# EAGLE design Qwiic_USB_Bridge_SAMD21E (EAGLE 9.5.2)
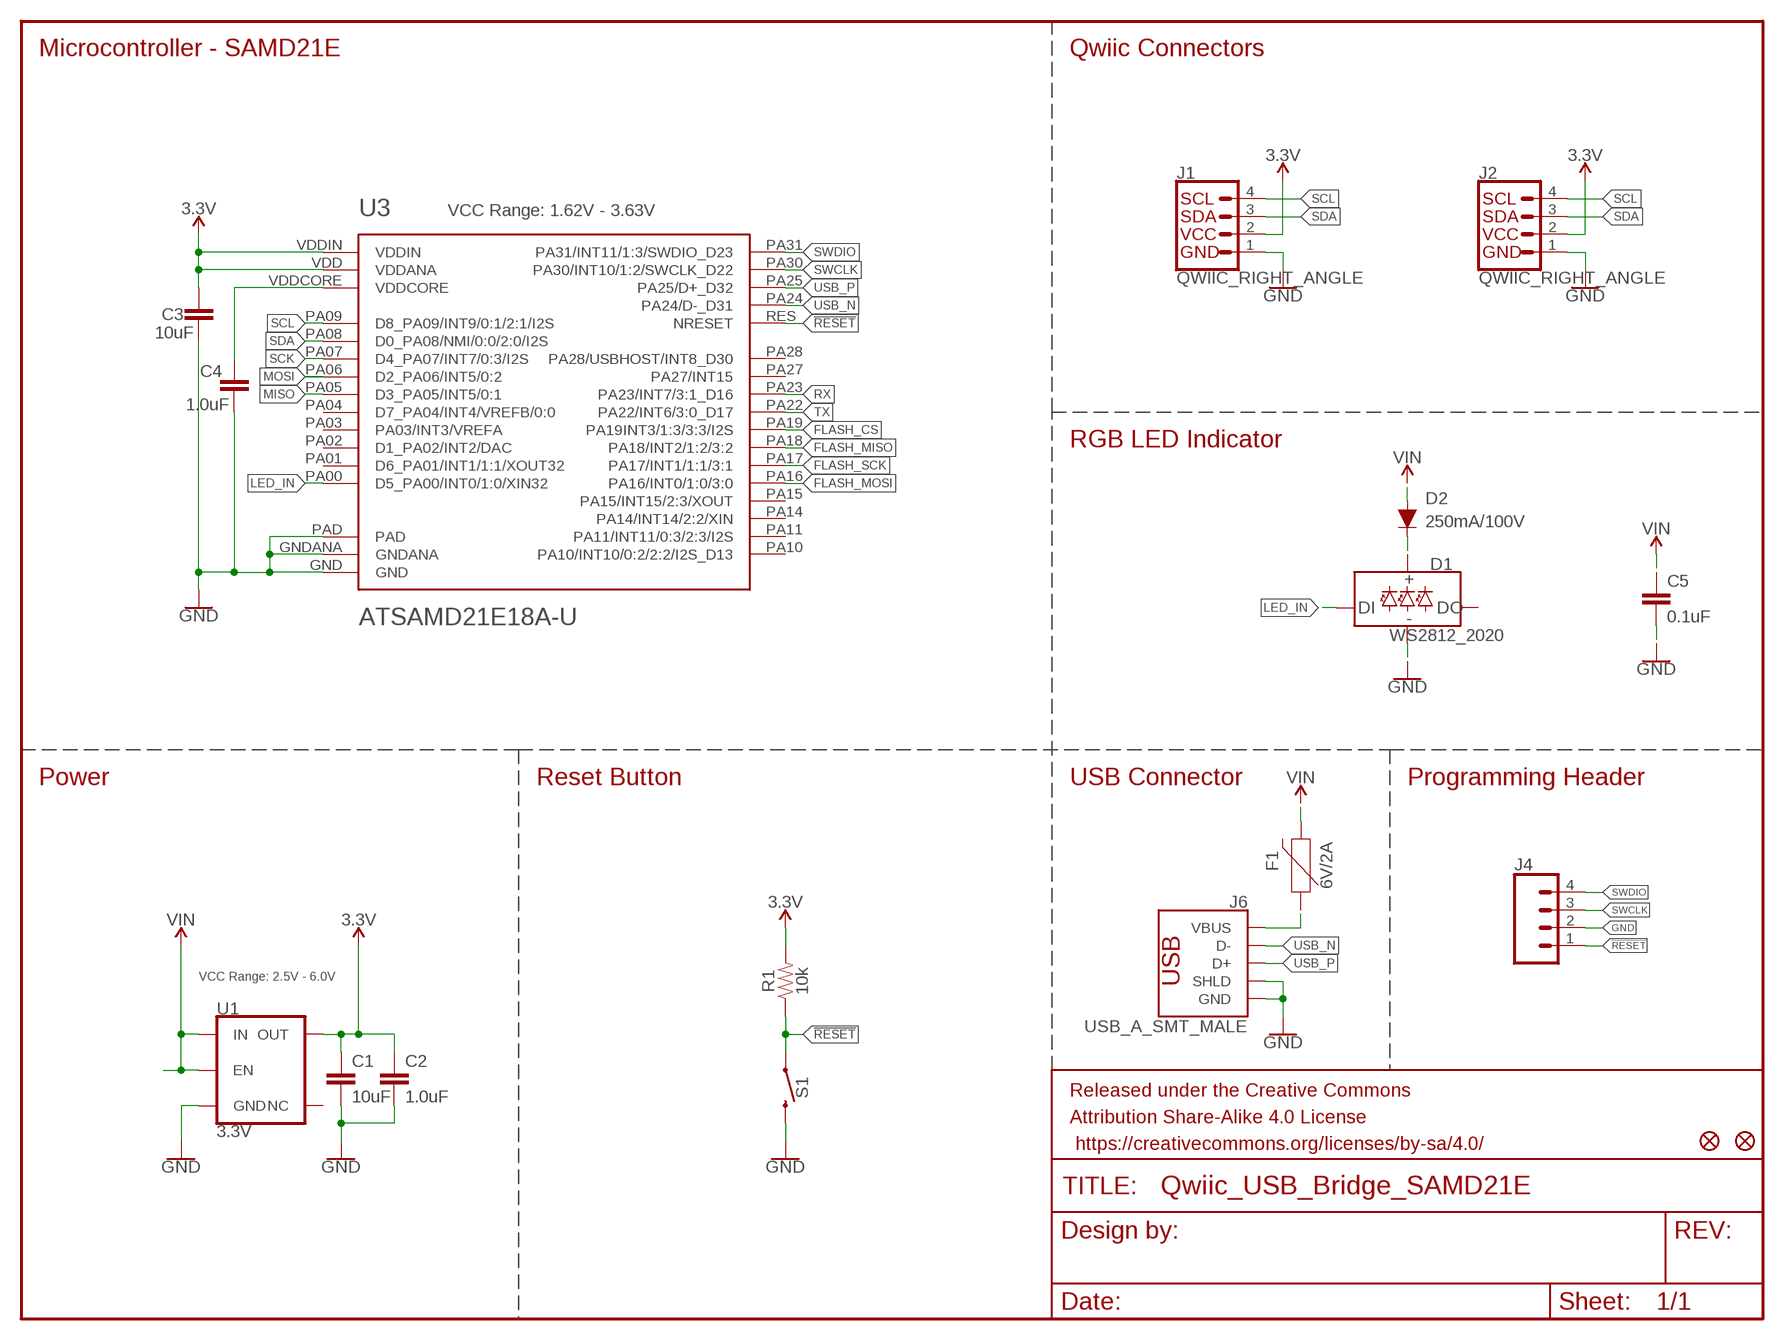
[diagram p0: schematic, sheet 1]

## Parts
C1  10uF  10UF-0603-6.3V-20%  [0603]
C2  1.0uF  1.0UF-0402-16V-10%  [0402]
C3  10uF  10UF-0603-6.3V-20%  [0603]
C4  1.0uF  1.0UF-0402-16V-10%  [0402]
C5  0.1uF  0.1UF-0603-25V-(+80/-20%)  [0603]
D1  WS2812_2020  [WS2812-2020]
D2  250mA/100V  DIODE-BAS16J  [SOD-323]
F1  6V/2A  PPTC_6V2A  [1210]
FD1  FIDUCIALUFIDUCIAL  [FIDUCIAL-MICRO]
FD2  FIDUCIALUFIDUCIAL  [FIDUCIAL-MICRO]
FRAME2  FRAME-LETTER  [CREATIVE_COMMONS]
J1  QWIIC_RIGHT_ANGLE  QWIIC_CONNECTORJS-1MM  [JST04_1MM_RA]
J2  QWIIC_RIGHT_ANGLE  QWIIC_CONNECTORJS-1MM  [JST04_1MM_RA]
J4  CONN_041.27MM_NO_SILK  [1X04_1.27MM_NO_SILK]
J6  USB_A_SMT_MALE  [USB-A-SMT-MALE]
R1  10k  10KOHM-0603-1/10W-1%  [0603]
S1  MOMENTARY-SWITCH-SPST-SMD-6.0X3.5MM  [TACTILE_SWITCH_SMD_6.0X3.5MM]
U1  3.3V  V_REG_AP2112K-3.3V  [SOT23-5]
U3  ATSAMD21E18A-U  [QFN-32_SAMD]

## Nets
3.3V: C1.1 C2.1 C3.1 J1.2 J2.2 R1.2 U1.5(OUT) U3.VDD(VDDANA) U3.VDDIN
!RESET: J4.1 R1.1 S1.1 U3.RES(NRESET)
FLASH_CS: U3.PA19(PA19INT3/1:3/3:3/I2S)
FLASH_MISO: U3.PA18(PA18/INT2/1:2/3:2)
FLASH_MOSI: U3.PA16(PA16/INT0/1:0/3:0)
FLASH_SCK: U3.PA17(PA17/INT1/1:1/3:1)
GND: C1.2 C2.2 C3.2 C4.1 C5.2 D1.GND J1.1 J2.1 J4.2 J6.GND1(GND) J6.SHLD1(SHLD) J6.SHLD2(SHLD) S1.2 U1.2(GND) U3.GND U3.GNDANA U3.PAD
LED_IN: D1.DI U3.PA00(D5_PA00/INT0/1:0/XIN32)
MISO: U3.PA05(D3_PA05/INT5/0:1)
MOSI: U3.PA06(D2_PA06/INT5/0:2)
N$1: F1.1 J6.VBUS1(VBUS)
N$2: D1.VCC D2.C
RX: U3.PA23(PA23/INT7/3:1_D16)
SCK: U3.PA07(D4_PA07/INT7/0:3/I2S)
SCL: J1.4 J2.4 U3.PA09(D8_PA09/INT9/0:1/2:1/I2S)
SDA: J1.3 J2.3 U3.PA08(D0_PA08/NMI/0:0/2:0/I2S)
SWCLK: J4.3 U3.PA30(PA30/INT10/1:2/SWCLK_D22)
SWDIO: J4.4 U3.PA31(PA31/INT11/1:3/SWDIO_D23)
TX: U3.PA22(PA22/INT6/3:0_D17)
USB_N: J6.D-1(D-) U3.PA24(PA24/D-_D31)
USB_P: J6.D+1(D+) U3.PA25(PA25/D+_D32)
VDDCORE: C4.2 U3.VDDCORE
VIN: C5.1 D2.A F1.2 U1.1(IN) U1.3(EN)
Unconnected: D1.DO U1.4(NC) U3.PA01(D6_PA01/INT1/1:1/XOUT32) U3.PA02(D1_PA02/INT2/DAC) U3.PA03(PA03/INT3/VREFA) U3.PA04(D7_PA04/INT4/VREFB/0:0) U3.PA10(PA10/INT10/0:2/2:2/I2S_D13) U3.PA11(PA11/INT11/0:3/2:3/I2S) U3.PA14(PA14/INT14/2:2/XIN) U3.PA15(PA15/INT15/2:3/XOUT) U3.PA27(PA27/INT15) U3.PA28(PA28/USBHOST/INT8_D30)

## Notes on the sheet
- Microcontroller - SAMD21E | Qwiic Connectors
- U3 | VCC Range: 1.62V - 3.63V
- RGB LED Indicator
- Power | Reset Button | USB Connector | Programming Header
- VCC Range: 2.5V - 6.0V

## Library data of the parts
C1 C3 = SparkFun-Capacitors:10UF: 10.0µF ceramic capacitors A capacitor is a passive two-terminal electrical component used to store electrical energy temporarily in an electric field.; PROD_ID: CAP-11015
C2 C4 = SparkFun-Capacitors:1.0UF: 1µF ceramic capacitors A capacitor is a passive two-terminal electrical component used to store electrical energy temporarily in an electric field.; PROD_ID: CAP-12417
C5 = SparkFun-Capacitors:0.1UF: 0.1µF ceramic capacitors A capacitor is a passive two-terminal electrical component used to store electrical energy temporarily in an electric field.; PROD_ID: CAP-00810
D1 = SparkFun-LED:WS2812: Addressable RGB LED - 1 Wire Common names: WS2812, SK6812, Neopixel, APA-106, etc. SMD LED with built-in controller IC. Color: Red/Green/Blue SparkFun Products: LED-SMD RGB (WS2812) <https://www.sparkfun.com/products/11821> LED - RGB Addressable, PTH, 5mm Diffused (5 Pack) <https://www.sparkfun.com/products/12986> LED - RGB Addressable, PTH, 5mm Clear (5 Pack) <https://www.sparkfun.com/products/12999> Blynk Board - ESP8266 <https://www.sparkfun.com/products/13794> Datasheet referenced for footprint: WS2812B-PTH <https://cdn.sparkfun.com/datasheets/Components/LED/COM-12877.pdf>; PROD_ID: DIO-15591
D2 = SparkFun-DiscreteSemi:DIODE: Diode These are standard reverse protection diodes and small signal diodes. SparkFun Products: SparkFun SparkPunk Sound Kit <https://www.sparkfun.com/products/11177> SparkFun ESP8266 Thing <https://www.sparkfun.com/products/13231>; PROD_ID: DIO-09646
F1 = SparkFun-Fuses:PPTC: Resettable Fuse PPTC Resettable Fuse. Really a sort of resistor with a polymeric positive temperature coefficient whose resistance increases dramatically with an increase in temperature. When heated by the power passing through the resistance rises causing the current to be limited, protecting the circuit. This is achieved by the transition of the polymer from a crystalline to an amorphous state where the conductive carbon separates breaking the conductive pathways found in the cool crystalline structure. When a PPTC cools back down it resumes conducting letting the circuit turn back on. SparkFun Products: SparkFun RedBoard - Programmed with Arduino <https://www.sparkfun.com/products/12757> Pro Micro - 5V/16MHz <https://www.sparkfun.com/products/12640> Arduino Pro 328 - 5V/16MHz <https://www.sparkfun.com/products/10915> MP3 Trigger <https://www.sparkfun.com/products/13720>; PROD_ID: RES-14313
FD1 FD2 = SparkFun-Aesthetics:FIDUCIAL: Fiducial Alignment Points Point-of-reference for pick-and-place machines and other optical instruments.
FRAME2 = SparkFun-Aesthetics:FRAME-LETTER: Schematic Frame - Letter Standard 8.5x11 US Letter frame
J1 J2 = SparkFun-Connectors:QWIIC_CONNECTOR: SparkFun I2C Standard Qwiic Connector An SMD 1mm pitch JST connector makes it easy and quick (get it? Qwiic?) to connect I2C devices to each other. The Qwiic system <http://www.sparkfun.com/qwiic> enables fast and solderless connection between popular platforms and various sensors and actuators. We carry 200mm <https://www.sparkfun.com/products/14204>, 100mm <https://www.sparkfun.com/products/14205>, 50mm <https://www.sparkfun.com/products/14206>, and breadboard friendly <https://www.sparkfun.com/products/14207> Qwiic cables. We also offer 10 pcs strips <https://www.sparkfun.com/products/14323> the SMD connectors.; PROD_ID: CONN-13694
J4 = SparkFun-Connectors:CONN_04: Multi connection point. Often used as Generic Header-pin footprint for 0.1 inch spaced/style header connections On any of the 0.1 inch spaced packages, you can populate with these: Break Away Headers - Straight <https://www.sparkfun.com/products/116> (PRT-00116) Break Away Male Headers - Right Angle <https://www.sparkfun.com/products/553> (PRT-00553) Female Headers <https://www.sparkfun.com/products/115> (PRT-00115) Break Away Headers - Machine Pin <https://www.sparkfun.com/products/117> (PRT-00117) Break Away Female Headers - Swiss Machine Pin <https://www.sparkfun.com/products/743> (PRT-00743) For SCREWTERMINALS and SPRING TERMINALS visit here: Screw Terimnals on SparkFun.com <https://www.sparkfun.com/search/results?term=Screw+Terminals> (5mm/3.5mm/2.54mm spacing) This device is also useful as a general connection point to wire up your design to another part of your project. Our various solder wires solder well into these plated through hole pads. Hook-Up Wire - Assortment (Stranded, 22 AWG) <https://www.sparkfun.com/products/11375> (PRT-11375) Hook-Up Wire - Assortment (Solid Core, 22 AWG) <https://www.sparkfun.com/products/11367> (PRT-11367) View the entire wire category on our website here <https://www.sparkfun.com/categories/141> Special notes: Molex polarized connector foot print use with SKU : PRT-08231 with associated crimp pins and housings. 1MM SMD Version SKU: PRT-10208
J6 = SparkFun-Connectors:USB_A: USB-A Connector Male and female variants, as well as PTH and SMT variants SparkFun Products: SparkFun XBee Explorer Dongle <https://www.sparkfun.com/products/11697> PTH Male SparkFun MicroView-USB Programmer <https://www.sparkfun.com/products/12924> SMT Male SparkFun USB Type A Female Breakout <https://www.sparkfun.com/products/12700> SMT Female; PROD_ID: CONN-11499
R1 = SparkFun-Resistors:10KOHM: 10kΩ resistor A resistor is a passive two-terminal electrical component that implements electrical resistance as a circuit element. Resistors act to reduce current flow, and, at the same time, act to lower voltage levels within circuits. - Wikipedia; PROD_ID: RES-00824
S1 = SparkFun-Switches:MOMENTARY-SWITCH-SPST: Momentary Switch (Pushbutton) - SPST Normally-open (NO) SPST momentary switches (buttons, pushbuttons). Variants PTH-12MM - 12mm square, through-hole Momentary Pushbutton Switch - 12mm Square <https://www.sparkfun.com/products/9190> (COM-09190) PTH-6.0MM, PTH-6.0MM-KIT - 6.0mm square, through-hole Mini Pushbutton Switch <https://www.sparkfun.com/products/97> (COM-00097) KIT package intended for soldering kit's - only one side of pads' copper is exposed. PTH-RIGHT-ANGLE-KIT - Right-angle, through-hole Right Angle Tactile Button <https://www.sparkfun.com/products/10791> - Used on SparkFun BigTime Watch Kit <https://www.sparkfun.com/products/11734> SMD-12MM - 12mm square, surface-mount Tactile Button - SMD (12mm) <https://www.sparkfun.com/products/12993> (COM-12993) Used on SparkFun PicoBoard <https://www.sparkfun.com/products/11888> SMD-4.5MM - 4.5mm Square Trackball Switch Used on SparkFun Blackberry Trackballer Breakout <https://www.sparkfun.com/products/13169> SMD-4.6MMX2.8MM - 4.60mm x 2.80mm, surface mount Used on SparkFun Pro Micro - RP2040 <https://www.sparkfun.com/products/17717> SMD-5.2MM, SMD-5.2-REDUNDANT - 5.2mm square, surface-mount Mini Pushbutton Switch - SMD <https://www.sparkfun.com/products/8720> (COM-08720) Used on Arduino Pro Mini <https://www.sparkfun.com/products/11114> REDUNDANT package connects both switch circuits together SMD-6.0X3.5MM - 6.0 x 3.5mm, surface mount Momentary Reset Switch SMD <https://www.sparkfun.com/products/8229> (COM-08229) SMD-6.2MM-TALL - 6.2mm square, surface mount Tactile Button - SMD (6mm) <https://www.sparkfun.com/products/12992> Used on SparkFun Digital Sandbox <https://www.sparkfun.com/products/12651> SMD-RIGHT-ANGLE - Right-angle, surface mount Used on SparkFun Block for Intel® Edison - Arduino <https://www.sparkfun.com/products/13036>; PROD_ID: SWCH-14278; SF_SKU: COM-08229
U1 = SparkFun-IC-Power:V_REG_AP2112: AP2112 - 600mA CMOS LDO Regulator w/ Enable The AP2112 is CMOS process low dropout linear regulator with enable function, the regulator delivers a guaranteed 600mA (min.) continuous load current. Features Output Voltage Accuracy: ±1.5% Output Current: 600mA (Min.) Foldback Short Current Protection: 50mA Enable Function to Turn ON/OFF VOUT Low Dropout Voltage (3.3V): 250mV (Typ.) @IOUT=600mA Excellent Load Regulation: 0.2%/A (Typ.) Excellent Line Regulation: 0.02%/V (Typ.) Low Quiescent Current: 55μA (Typ.) Low Standby Current: 0.01μA (Typ.) Low Output Noise: 50μVRMS PSRR: 100Hz -65dB, 1kHz -65dB OTSD Protection Stable with 1.0μF Flexible Cap: Ceramic, Tantalum and Aluminum Electrolytic Operation Temperature Range: -40°C to 85°C ESD: MM 400V, HBM 4000V; PROD_ID: VREG-12457
U3 = SparkFun-IC-Microcontroller:ATSAMD21E18A-U: SAM D21E 32-Pin QFN The SAMD21E is built around the 32-bit ARM Cortex-M0+ processor with up to 256KB of Flash and 32KB of SRAM. It operates at a maximum frequency of 48MHz.; PROD_ID: IC-14428

## Net classes
1 vcc: width 0 mm

## Board
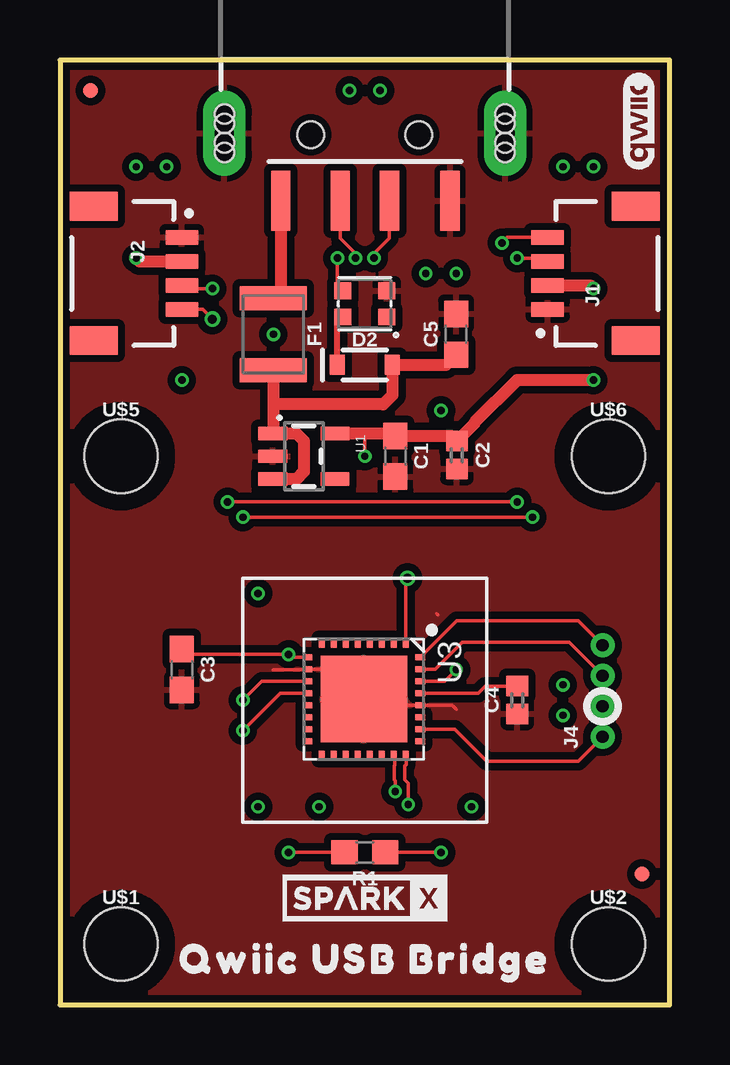
[diagram p1: board, top side]
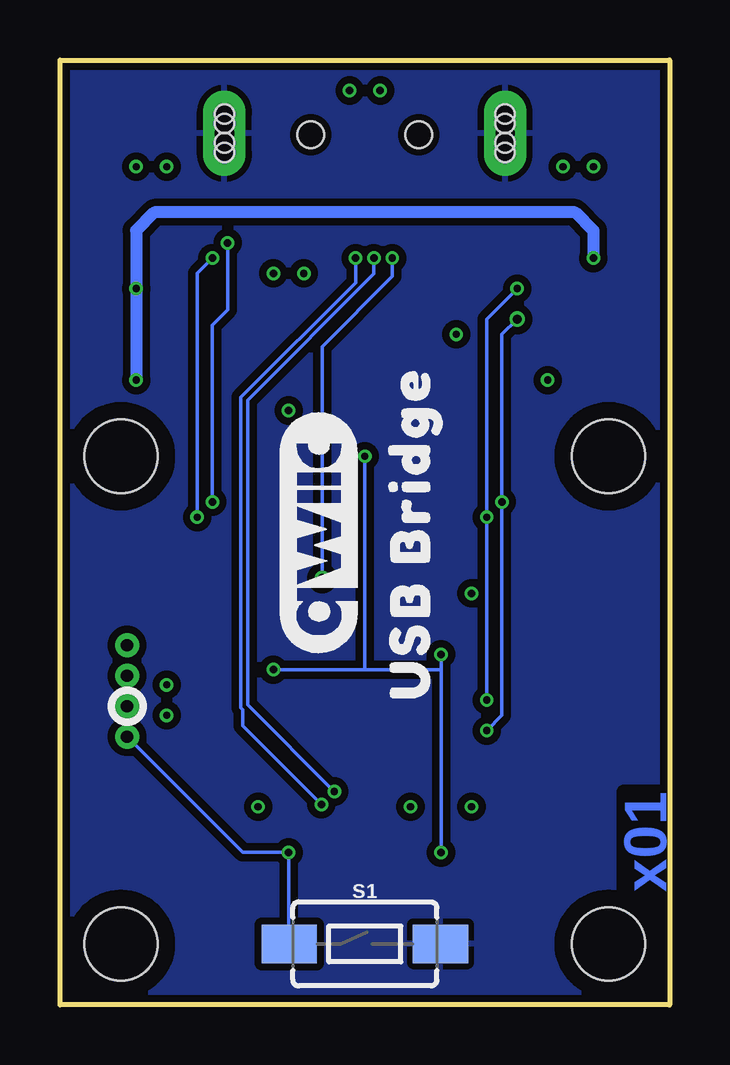
[diagram p2: board, bottom side, seen from below]

Size 25.4 x 39.37 mm. Coordinates in mm from the lower left corner, seen from the top.
Outline: 0,0 25.4,0 25.4,39.37 0,39.37 0,0
Copper layers (1*16): Top 0.035mm / dielectric 1.5mm / Bottom 0.035mm
Design rules "SparkFun-2-Layer-Minimum-JLCPCB": minimum track width 5mil, minimum drill 0.3mm, track to track 5mil, track to pad 5mil, pad to pad 5mil, via to via 5mil, smd to smd 5mil, copper to edge 7mil, drill to drill 7mil, minimum pad ring 5mil, minimum via ring 5mil, stop-mask expansion 4mil, vias tented up to drill 25mil, thermal gap 10mil

### Footprints (pad centres in the part's own frame; a part is rotated, then mirrored left to right if it is on the bottom)
0603 = smd 1.1 x 1: 1 -0.85,0; 2 0.85,0
0402 = smd 0.85 x 0.9: 1 -0.58,0; 2 0.58,0
WS2812-2020 = smd 0.7 x 0.7: DI -0.915,0.55; DO 0.915,-0.55; GND 0.915,0.55; VCC -0.915,-0.55
SOD-323 = smd 0.63 x 0.83: A 1.15,0; C -1.15,0
1210 = smd 1 x 2.8: 1 -1.5,0; 2 1.5,0
FIDUCIAL-MICRO = smd 0.635 x 0.635: 1 0,0
JST04_1MM_RA = smd 0.6 x 1.35: 1 -1.5,0; 2 -0.5,0; 3 0.5,0; 4 1.5,0 | smd 1.2 x 2: NC1 2.8,-3.675; NC2 -2.8,-3.675
1X04_1.27MM_NO_SILK = drill 0.508 pad 1: 1 0,0; 2 1.27,0; 3 2.54,0; 4 3.81,0
USB-A-SMT-MALE = smd 2.5 x 0.8: D+1 10.95,1.027; D-1 10.95,-1.027; GND1 10.95,3.551; VBUS1 10.95,-3.5 | drill 0.8 pad 1.778 long: SHLD1 8.13,-5.85; SHLD2 8.13,5.85 | hole 1.1: 8.2,2.25; 8.2,-2.25 | hole 0.8: 8.53,-5.85; 8.93,-5.85; 7.73,-5.85; 7.33,-5.85; 8.53,5.85; 8.93,5.85; 7.73,5.85; 7.33,5.85
TACTILE_SWITCH_SMD_6.0X3.5MM = smd 2.3 x 1.6: 1 -3.15,0; 2 3.15,0
SOT23-5 = smd 0.55 x 1.2: 1 -0.95,-1.3; 2 0,-1.3; 3 0.95,-1.3; 4 0.95,1.3; 5 -0.95,1.3
QFN-32_SAMD = smd 0.25 x 0.4: GND 0.21,2.31; GNDANA -1.29,-2.39; PA08 -0.79,-2.39; PA09 -0.29,-2.39; PA10 0.21,-2.39; PA11 0.71,-2.39; PA14 1.21,-2.39; PA15 1.71,-2.39; PA27 1.71,2.31; PA28 0.71,2.31; PA30 -1.29,2.31; PA31 -1.79,2.31; RES 1.21,2.31; VDD -1.79,-2.39; VDDCORE -0.29,2.31; VDDIN -0.79,2.31 | smd 0.4 x 0.25: PA00 -2.39,1.71; PA01 -2.39,1.21; PA02 -2.39,0.71; PA03 -2.39,0.21; PA04 -2.39,-0.29; PA05 -2.39,-0.79; PA06 -2.39,-1.29; PA07 -2.39,-1.79; PA16 2.31,-1.79; PA17 2.31,-1.29; PA18 2.31,-0.79; PA19 2.31,-0.29; PA22 2.31,0.21; PA23 2.31,0.71; PA24 2.31,1.21; PA25 2.31,1.71 | smd 3.6 x 3.6: PAD -0.04,-0.04
STAND-OFF-TIGHT = hole 3.048: 0,0

### Placement (x,y rotation side)
C1  13.97,22.86 270 top
C2  16.54,22.91 270 top
C3  5.08,13.97 270 top
C4  19.05,12.7 90 top
C5  16.51,27.94 90 top
D1  12.7,29.21 0 top
D2  12.7,26.67 0 top
F1  8.89,27.94 270 top
FD1  1.27,38.1 0 top
FD2  24.26,5.46 0 top
FRAME2  -10.16,-11.43 0 top  (outside the outline)
J1  20.32,30.48 90 top
J2  5.08,30.48 270 top
J4  22.61,11.18 90 top
J6  12.7,44.45 270 top
R1  12.7,6.35 180 top
S1  12.7,2.54 0 bottom
U1  10.16,22.86 270 top
U3  12.7,12.7 270 top
U$1  [STAND-OFF-TIGHT]  2.54,2.54 0 top
U$2  [STAND-OFF-TIGHT]  22.86,2.54 0 top
U$3  [QWIIC_USB_BRIDGE0]  12.7,1.91 0 top
U$4  [SPARKX-SMALL]  12.7,4.45 0 top
U$5  [STAND-OFF-TIGHT]  2.54,22.86 0 top
U$6  [STAND-OFF-TIGHT]  22.86,22.86 0 top
U$7  [QWIIC_10MM]  14.61,19.68 90 bottom
U$8  [USB_BRIDGE0]  10.79,19.68 90 bottom
U$9  [QWIIC_4MM]  24.13,36.83 90 top

### Tracks (layer width: path | path; a pad name or v marks a point on that pad's centre or on a via)
3.3V  (via drill 0.3)
  Top 0.152: U3.VDD 9.77,14.49 9.65,14.61 v9.53,14.61 5.29,14.61 C3.1 | v16.51,13.97 16.03,13.49 U3.VDDIN | R1.2 v9.53,6.35 | 12.7,23.81 v12.7,22.86
  Top 0.254: 13.87,23.81 C1.1 | 16.32,23.71 C2.1 | 17.27,24.25 17.27,24.22
  Top 0.508: U1.5 12.7,23.81 13.87,23.81 | C1.1 16.32,23.71 | J2.2 3.31,30.98 v3.17,31.11 | v22.23,29.84 22.1,29.97 J1.2 | v22.23,26.04 19.05,26.04 17.27,24.25 | 17.27,24.22 C2.1
  Bottom 0.152: v16.51,13.97 12.7,13.97 | v12.7,22.86 12.7,13.97 | v9.53,6.35 9.53,13.97 | 9.53,13.97 v9.53,14.61 | 12.7,13.97 9.53,13.97
  Bottom 0.508: v22.23,26.04 v22.23,29.84 22.23,32.26 21.46,33.02 3.94,33.02 3.17,32.26 v3.17,31.11
!RESET  (via drill 0.3)
  Top 0.152: U3.RES 16.45,11.49 17.78,10.16 21.59,10.16 J4.1 | R1.1 v15.88,6.35
  Bottom 0.152: S1.1 15.88,2.56 v15.88,6.35 17.78,6.35 J4.1
GND
  Top 0.152: 15.7,16.3 15.75,16.26 | 8.89,13.97 10.29,13.97 U3.GNDANA 11.41,13.99 U3.PAD 12.91,12.49 U3.GND 16.34,12.49 16.51,12.32
  pour Top (isolate 0.305): 0,0 0,39.37 25.4,39.37 25.4,0
  pour Bottom (isolate 0.305): 0,39.37 25.4,39.37 25.4,0 0,0
LED_IN  (via drill 0.3, 0.38)
  Top 0.152: D1.DI 11.56,29.99 v11.56,31.11 | v14.48,17.78 14.41,17.71 U3.PA00
  Bottom 0.152: v11.56,31.11 11.56,30.35 14.48,27.43 v14.48,17.78
N$1
  Top 0.254: 9.2,29.75 F1.1
  Top 0.508: J6.VBUS1 9.2,29.75
N$2
  Top 0.254: D2.C 11.55,28.43 D1.VCC
N$3  (via drill 0.3)
  other vias: 17.14,8.26
N$4  (via drill 0.3)
  other vias: 10.79,8.26
N$5  (via drill 0.3)
  other vias: 8.26,8.26
N$6  (via drill 0.3)
  other vias: 8.26,17.14
N$7  (via drill 0.3)
  other vias: 20.95,13.34
N$8  (via drill 0.3)
  other vias: 20.95,12.06
N$9  (via drill 0.3)
  other vias: 15.88,24.77
N$10  (via drill 0.3)
  other vias: 8.89,27.94
N$11  (via drill 0.3)
  other vias: 15.24,30.48
N$12  (via drill 0.3)
  other vias: 16.51,30.48
N$13  (via drill 0.3)
  other vias: 12.06,38.1
N$14  (via drill 0.3)
  other vias: 13.34,38.1
N$15  (via drill 0.3)
  other vias: 4.45,34.92
N$16  (via drill 0.3)
  other vias: 3.17,34.92
N$17  (via drill 0.3)
  other vias: 20.95,34.92
N$18  (via drill 0.3)
  other vias: 22.23,34.92
N$19  (via drill 0.3)
  other vias: 5.08,26.04
SCL  (via drill 0.3, 0.38)
  Top 0.152: U3.PA09 9.18,12.99 v7.62,11.43 | v6.35,28.57 5.95,28.98 J2.4 | v6.99,20.95 v19.05,20.95 | J1.4 18.64,31.98 v18.41,31.75
  Bottom 0.152: v7.62,11.43 6.99,12.06 v6.99,20.95 6.99,27.94 v6.35,28.57 | v19.05,20.95 19.05,28.32 18.41,28.96 v18.41,31.75
SDA  (via drill 0.3)
  Top 0.152: v6.35,29.84 5.21,29.84 J2.3 | U3.PA08 8.41,13.49 v7.62,12.7 | v7.62,20.32 v19.68,20.32 | v19.05,31.11 20.18,31.11 J1.3
  Bottom 0.152: v6.35,29.84 7.62,28.57 v7.62,20.32 v7.62,12.7 | v19.68,20.32 19.68,30.48 v19.05,31.11
SWCLK
  Top 0.152: U3.PA30 15.64,13.99 16.76,15.11 21.21,15.11 J4.3
SWDIO
  Top 0.152: U3.PA31 16.52,16 21.59,16 J4.4
USB_N  (via drill 0.3)
  Top 0.152: J6.D-1 11.67,31.95 12.32,31.3 v12.32,31.11 | U3.PA24 13.96,10.39 13.96,9.99 13.93,9.96 13.93,9.39 13.97,9.35 v13.97,8.89
  Bottom 0.152: v12.32,31.11 12.32,30.47 17.58,25.2 17.58,12.5 v13.97,8.89
USB_P  (via drill 0.3)
  Top 0.152: J6.D+1 13.73,31.95 13.08,31.3 v13.08,31.11 | U3.PA25 14.42,10.01 14.37,9.96 14.37,9.38 14.51,9.23 v14.51,8.35
  Bottom 0.152: v13.08,31.11 13.08,30.1 17.86,25.32 17.86,12.39 17.78,12.3 17.78,11.62 v14.51,8.35
VDDCORE
  Top 0.152: U3.VDDCORE 17.43,12.99 17.73,13.28 C4.2
VIN
  Top 0.254: 8.89,23.84 U1.1
  Top 0.508: F1.2 8.89,25.02 | 8.89,25.02 8.89,23.84 | U1.1 9.85,23.81 10.16,23.5 10.16,22.23 9.85,21.91 U1.3 | C5.1 16.09,26.67 D2.A 13.85,25.41 13.46,25.02 8.89,25.02

### Text on the board
Bottom: x01
Measures: Units in Inches